# EAGLE design OBD-Schematic (EAGLE 7.4.0)

## Sheet 1 of 4: Power Section
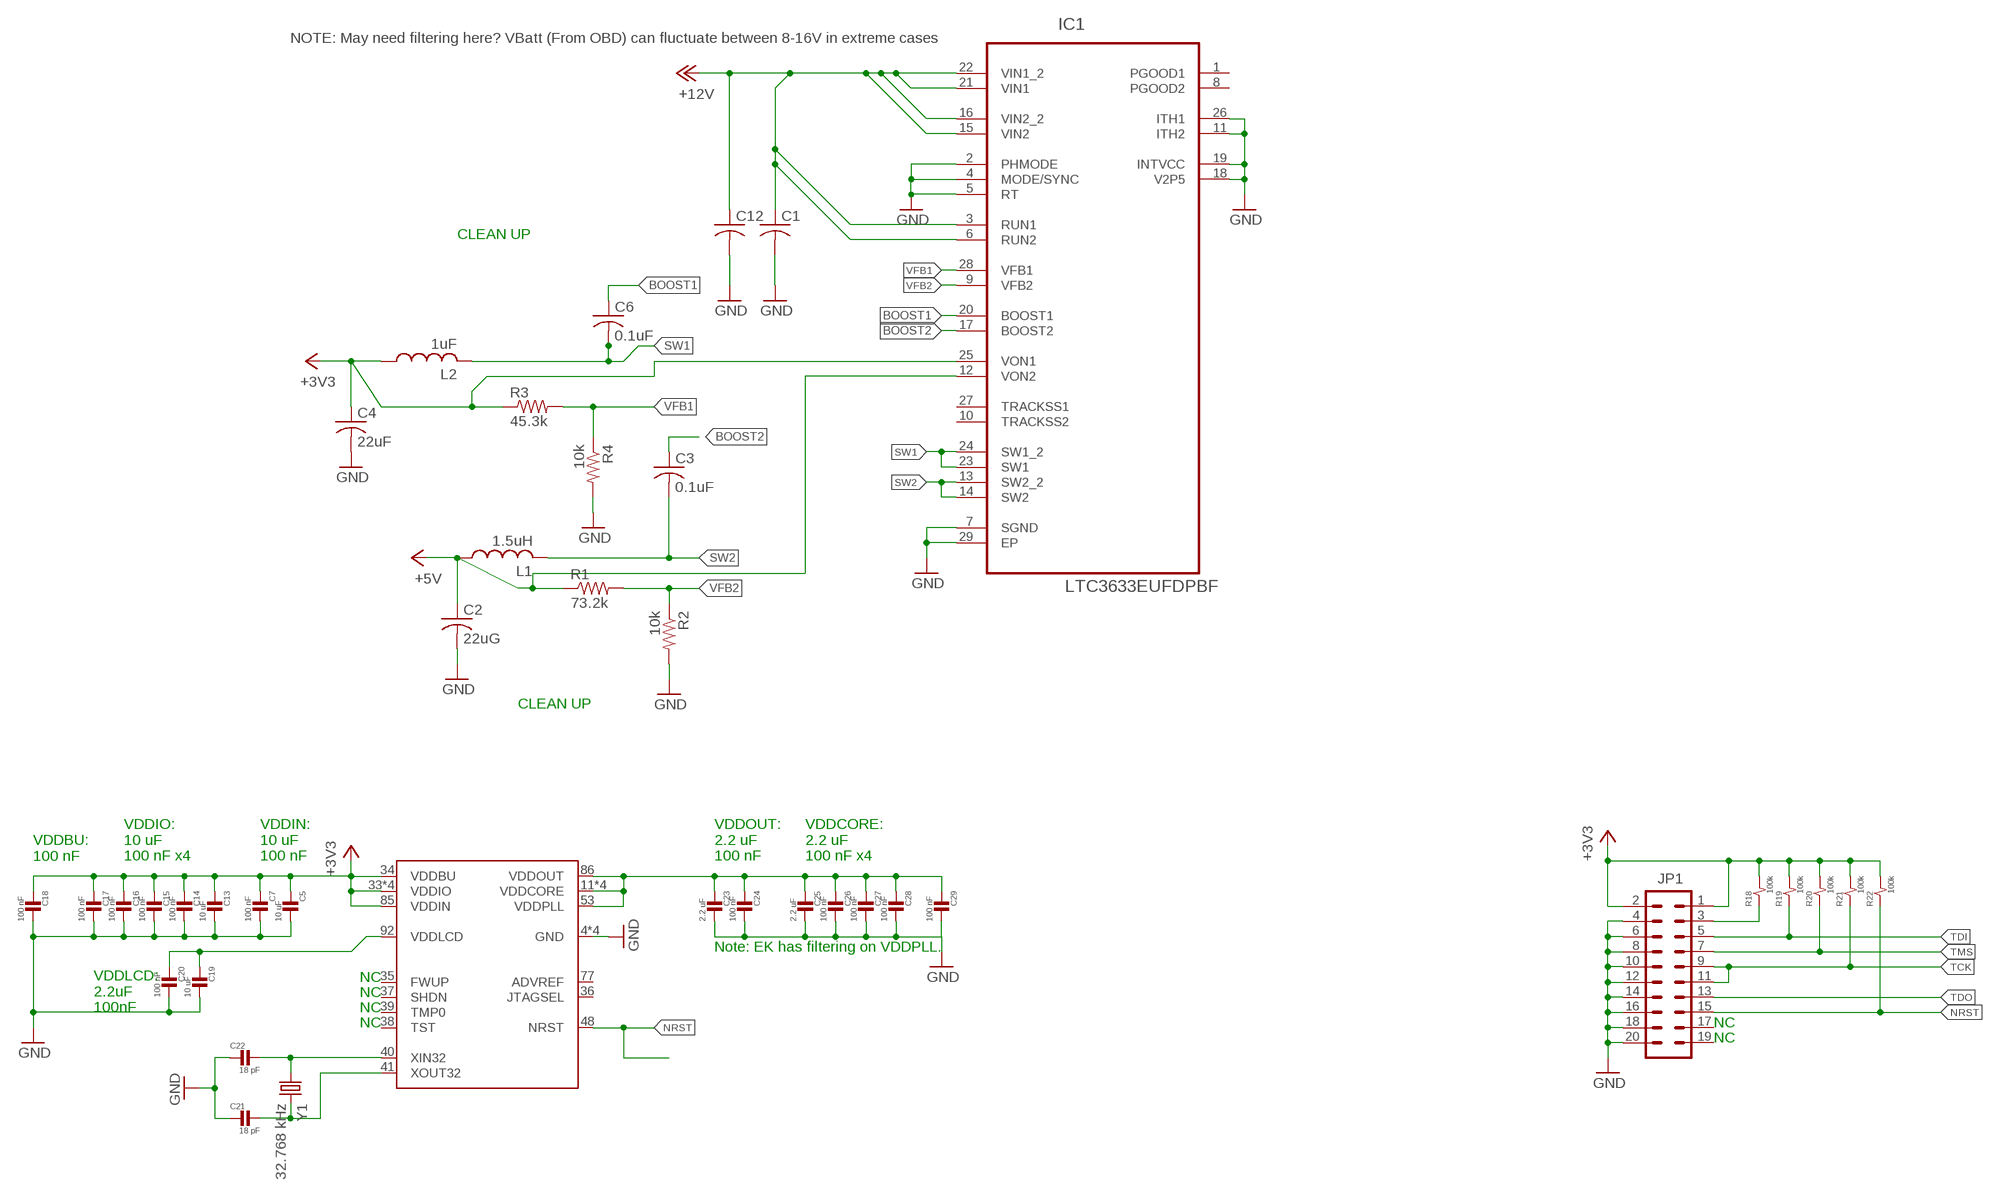
[diagram p0: schematic, sheet 1]

### Parts
C1  C-USC0805  [C0805]
C2  22uG  C-USC0805  [C0805]
C3  0.1uF  C-USC0805  [C0805]
C4  22uF  C-USC0805  [C0805]
C5  10 uF  C0603  [C0603]
C6  0.1uF  C-USC0805  [C0805]
C7  100 nF  C0603  [C0603]
C12  C-USC0805  [C0805]
C13  10 uF  C0603  [C0603]
C14  100 nF  C0603  [C0603]
C15  100 nF  C0603  [C0603]
C16  100 nF  C0603  [C0603]
C17  100 nF  C0603  [C0603]
C18  100 nF  C0603  [C0603]
C19  10 uF  C0603  [C0603]
C20  100 nF  C0603  [C0603]
C21  18 pF  C0603  [C0603]
C22  18 pF  C0603  [C0603]
C23  2.2 uF  C0603  [C0603]
C24  100 nF  C0603  [C0603]
C25  2.2 uF  C0603  [C0603]
C26  100 nF  C0603  [C0603]
C27  100 nF  C0603  [C0603]
C28  100 nF  C0603  [C0603]
C29  100 nF  C0603  [C0603]
IC1  LTC3633EUFDPBF  [QFN50P400X500X80-29N]
JP1  M10X2  [2X10]
L1  1.5uH  L-USL5650M  [L5650M]
L2  1uF  L-USL5650M  [L5650M]
R1  73.2k  R-US_R0805  [R0805]
R2  10k  R-US_R0805  [R0805]
R3  45.3k  R-US_R0805  [R0805]
R4  10k  R-US_R0805  [R0805]
R18  100k  R0603  [R0603]
R19  100k  R0603  [R0603]
R20  100k  R0603  [R0603]
R21  100k  R0603  [R0603]
R22  100k  R0603  [R0603]
U$3  SAM4C32C-100  [LQFP-100]
Y1  32.768 kHz  CRYSTALSM49  [SM49]

### Nets
+3V3: C4.1 C5.1 C7.1 C13.1 C14.1 C15.1 C16.1 C17.1 C18.1 IC1.25(VON1) JP1.1 JP1.2 L2.1 R3.1 R18.2 R19.2 R20.2 R21.2 R22.2 U$3.33(VDDIO) U$3.34(VDDBU) U$3.49(VDDIO) U$3.76(VDDIO) U$3.85(VDDIN) U$3.99(VDDIO) ; also sheet 2,3
+5V: C2.1 IC1.12(VON2) L1.1 R1.1 ; also sheet 3,4
BOOST1: C6.1 IC1.20(BOOST1)
BOOST2: C3.1 IC1.17(BOOST2)
GND: C1.2 C2.2 C4.2 C5.2 C7.2 C12.2 C13.2 C14.2 C15.2 C16.2 C17.2 C18.2 C19.2 C20.2 C21.1 C22.1 C23.2 C24.2 C25.2 C26.2 C27.2 C28.2 C29.2 IC1.2(PHMODE) IC1.4(MODE/SYNC) IC1.5(RT) IC1.7(SGND) IC1.11(ITH2) IC1.18(V2P5) IC1.19(INTVCC) IC1.26(ITH1) IC1.29(EP) JP1.4 JP1.6 JP1.8 JP1.10 JP1.12 JP1.14 JP1.16 JP1.18 JP1.20 R2.2 R4.2 U$3.4(GND) U$3.42(GND) U$3.52(GND) U$3.78(GND) ; also sheet 2,3,4
N$1: JP1.3 R18.1
N$11: C22.2 U$3.40(XIN32) Y1.1
N$12: C21.2 U$3.41(XOUT32) Y1.2
NRST: JP1.15 R22.1 U$3.48(NRST)
SW1: C6.2 IC1.23(SW1) IC1.24(SW1_2) L2.2
SW2: C3.2 IC1.13(SW2_2) IC1.14(SW2) L1.2
TCK: JP1.9 JP1.11 R21.1 ; also sheet 2
TDI: JP1.5 R19.1 ; also sheet 2
TDO: JP1.13 ; also sheet 2
TMS: JP1.7 R20.1 ; also sheet 2
VDDLCD: C19.1 C20.1 U$3.92(VDDLCD)
VDDOUT: C23.1 C24.1 C25.1 C26.1 C27.1 C28.1 C29.1 U$3.11(VDDCORE) U$3.44(VDDCORE) U$3.53(VDDPLL) U$3.63(VDDCORE) U$3.86(VDDOUT) U$3.89(VDDCORE)
VFB1: IC1.28(VFB1) R3.2 R4.1
VFB2: IC1.9(VFB2) R1.2 R2.1
VIN: C1.1 C12.1 IC1.3(RUN1) IC1.6(RUN2) IC1.15(VIN2) IC1.16(VIN2_2) IC1.21(VIN1) IC1.22(VIN1_2) ; supply symbol labelled +12V ; also sheet 2,3
Unconnected: IC1.1(PGOOD1) IC1.8(PGOOD2) IC1.10(TRACKSS2) IC1.27(TRACKSS1) JP1.17 JP1.19 U$3.35(FWUP) U$3.36(JTAGSEL) U$3.37(SHDN) U$3.38(TST) U$3.39(TMP0) U$3.77(ADVREF)

### Notes on the sheet
- NOTE: May need filtering here? VBatt (From OBD) can fluctuate between 8-16V in extreme cases
- CLEAN UP
- CLEAN UP
- VDDBU:
  100 nF
- VDDIO:
  10 uF
  100 nF x4
- VDDIN:
  10 uF
  100 nF
- VDDOUT:
  2.2 uF
  100 nF
- VDDCORE:
  2.2 uF
  100 nF x4
- Note: EK has filtering on VDDPLL.
- NC
- NC
- VDDLCD:
  2.2uF
  100nF
- NC
- NC | NC
- NC

## Sheet 2 of 4
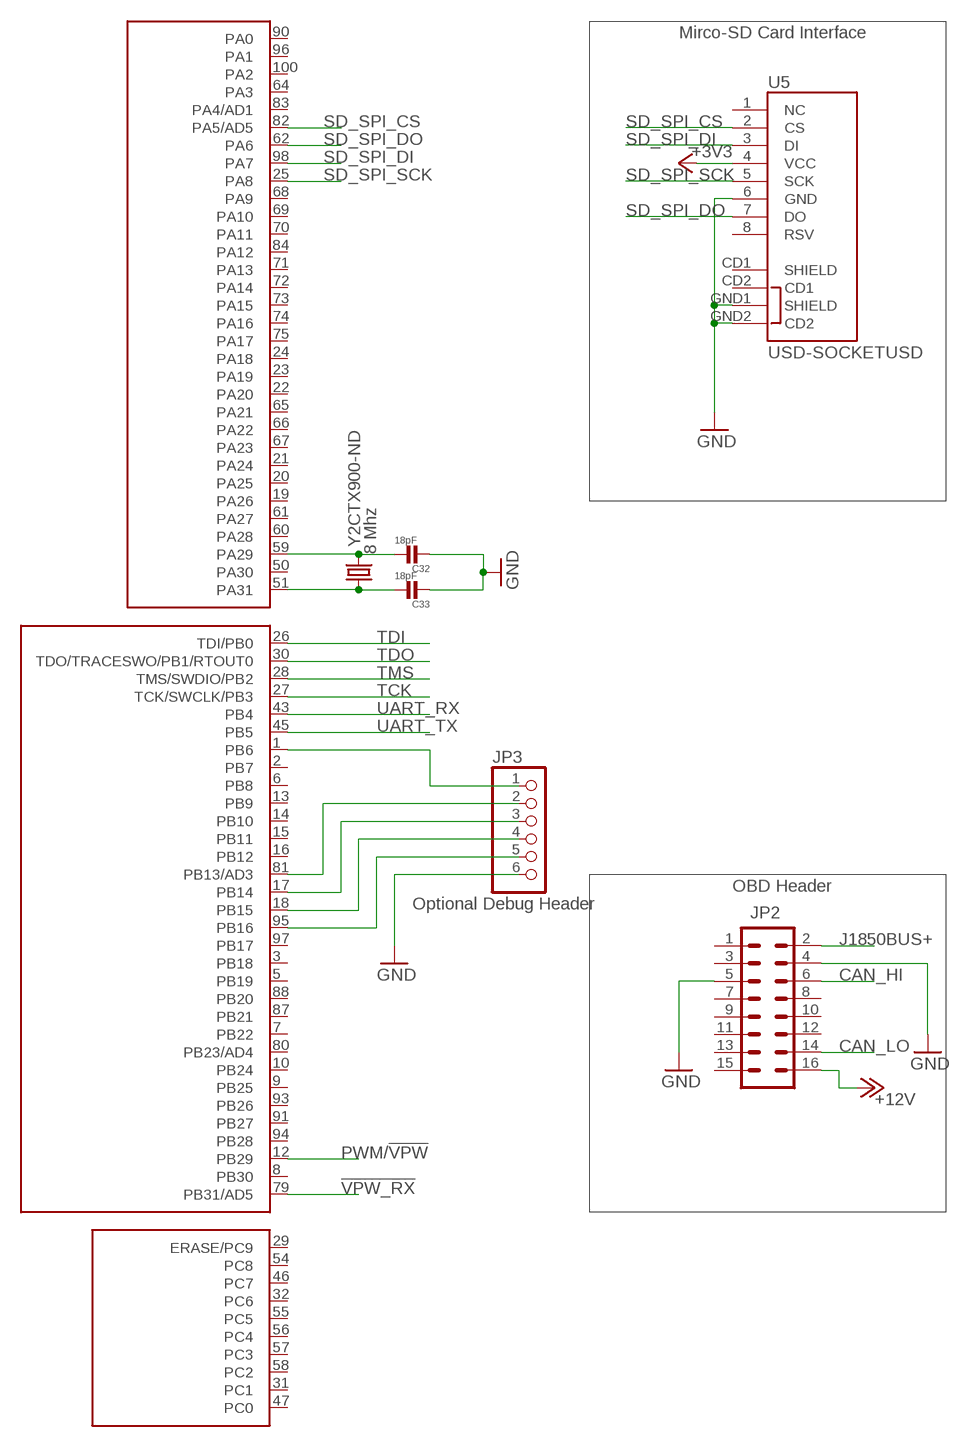
[diagram p1: schematic, sheet 2]

### Parts
C32  18pF  C0603  [C0603]
C33  18pF  C0603  [C0603]
JP2  M08X2  [2X8]
JP3  PINHD-1X6CLEAN  [1X06-CLEAN]
U5  USD-SOCKETUSD  [USD-SOCKET-PP]
Y2CTX900-ND  8 Mhz  CRYSTALHC49US  [HC49US]

### Nets
!VPW_RX: U$3.79(PB31/AD5) ; also sheet 3
+3V3: U5.4(VCC) ; also sheet 1,3
CAN_HI: JP2.6 ; also sheet 3
CAN_LO: JP2.14 ; also sheet 3
GND: C32.1 C33.1 JP2.4 JP2.5 JP3.6 U5.6(GND) U5.GND1(SHIELD) U5.GND2(CD2) ; also sheet 1,3,4
J1850BUS+: JP2.2 ; also sheet 3
N$18: C33.2 U$3.51(PA31) Y2CTX900-ND.1
N$22: C32.2 U$3.59(PA29) Y2CTX900-ND.2
N$31: JP3.1 U$3.1(PB6)
N$32: JP3.2 U$3.81(PB13/AD3)
N$34: JP3.3 U$3.17(PB14)
N$35: JP3.4 U$3.18(PB15)
N$36: JP3.5 U$3.95(PB16)
PWM/!VPW: U$3.12(PB29) ; also sheet 3
SD_SPI_CS: U5.2(CS) U$3.82(PA5/AD5)
SD_SPI_DI: U5.3(DI) U$3.98(PA7)
SD_SPI_DO: U5.7(DO) U$3.62(PA6)
SD_SPI_SCK: U5.5(SCK) U$3.25(PA8)
TCK: U$3.27(TCK/SWCLK/PB3) ; also sheet 1
TDI: U$3.26(TDI/PB0) ; also sheet 1
TDO: U$3.30(TDO/TRACESWO/PB1/RTOUT0) ; also sheet 1
TMS: U$3.28(TMS/SWDIO/PB2) ; also sheet 1
UART_RX: U$3.43(PB4) ; also sheet 4
UART_TX: U$3.45(PB5) ; also sheet 4
VIN: JP2.16 ; supply symbol labelled +12V ; also sheet 1,3
Unconnected: JP2.1 JP2.3 JP2.7 JP2.8 JP2.9 JP2.10 JP2.11 JP2.12 JP2.13 JP2.15 U5.1(NC) U5.8(RSV) U5.CD1(SHIELD) U5.CD2(CD1) U$3.2(PB7) U$3.3(PB18) U$3.5(PB19) U$3.6(PB8) U$3.7(PB22) U$3.8(PB30) U$3.9(PB25) U$3.10(PB24) U$3.13(PB9) U$3.14(PB10) U$3.15(PB11) U$3.16(PB12) U$3.19(PA26) U$3.20(PA25) U$3.21(PA24) U$3.22(PA20) U$3.23(PA19) U$3.24(PA18) U$3.29(ERASE/PC9) U$3.31(PC1) U$3.32(PC6) U$3.46(PC7) U$3.47(PC0) U$3.50(PA30) U$3.54(PC8) U$3.55(PC5) U$3.56(PC4) U$3.57(PC3) U$3.58(PC2) U$3.60(PA28) U$3.61(PA27) U$3.64(PA3) U$3.65(PA21) U$3.66(PA22) U$3.67(PA23) U$3.68(PA9) U$3.69(PA10) U$3.70(PA11) U$3.71(PA13) U$3.72(PA14) U$3.73(PA15) U$3.74(PA16) U$3.75(PA17) U$3.80(PB23/AD4) U$3.83(PA4/AD1) U$3.84(PA12) U$3.87(PB21) U$3.88(PB20) U$3.90(PA0) U$3.91(PB27) U$3.93(PB26) U$3.94(PB28) U$3.96(PA1) U$3.97(PB17) U$3.100(PA2)

### Notes on the sheet
- Mirco-SD Card Interface
- OBD Header
- Optional Debug Header

## Sheet 3 of 4: Interface J1850 VPW and CAN Interface for GM
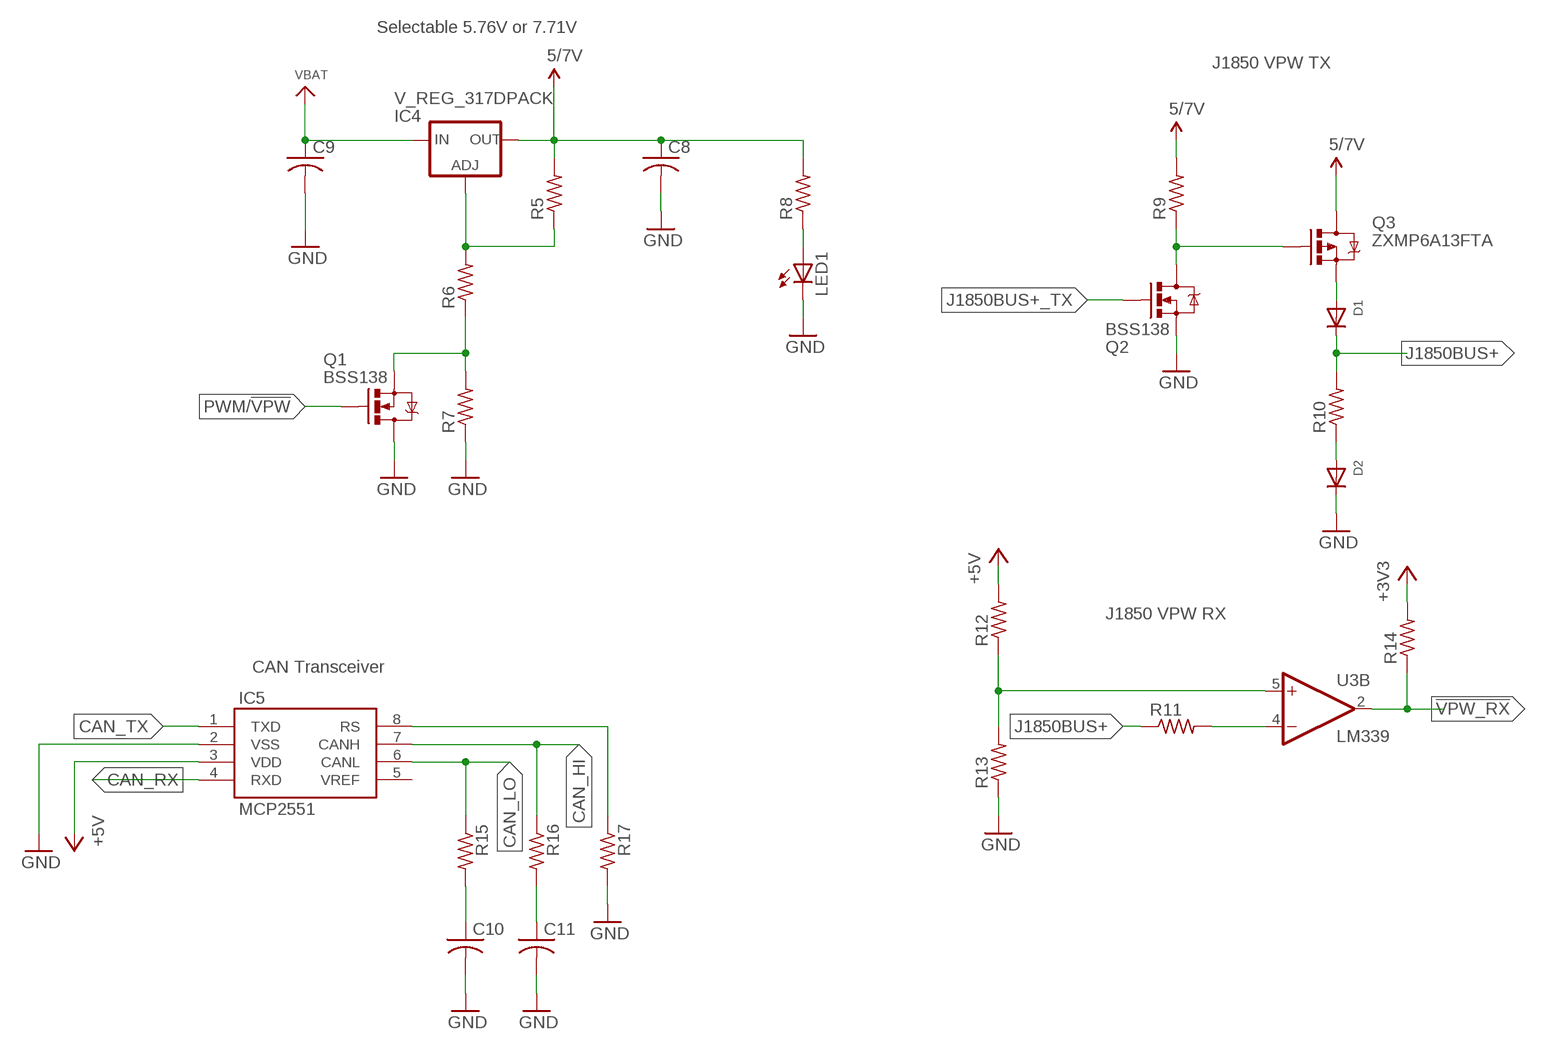
[diagram p2: schematic, sheet 3]

### Parts
C8  C-USC0805  [C0805]
C9  C-USC0805  [C0805]
C10  C-USC0805  [C0805]
C11  C-USC0805  [C0805]
D1  DIODESOT23_REFLOW  [SOT23-R]
D2  DIODESOT23_REFLOW  [SOT23-R]
IC4  V_REG_317DPACK  [V-REG_DPACK]
IC5  MCP2551  [SO08]
LED1  LEDCHIP-LED0805  [CHIP-LED0805]
Q1  BSS138  MOSFET-NCHANNELBSS123LT1G  [SOT23-3]
Q2  BSS138  MOSFET-NCHANNELBSS123LT1G  [SOT23-3]
Q3  ZXMP6A13FTA  MOSFET-PCHANNEL  [SOT23-3]
R5  R-US_R0805  [R0805]
R6  R-US_R0805  [R0805]
R7  R-US_R0805  [R0805]
R8  R-US_R0805  [R0805]
R9  R-US_R0805  [R0805]
R10  R-US_R0805  [R0805]
R11  R-US_R0805  [R0805]
R12  R-US_R0805  [R0805]
R13  R-US_R0805  [R0805]
R14  R-US_R0805  [R0805]
R15  R-US_R0805  [R0805]
R16  R-US_R0805  [R0805]
R17  R-US_R0805  [R0805]
U3  LM339  [TSSOP-14]

### Nets
5/7V: C8.1 IC4.4(OUT) Q3.3(D) R5.2 R8.2 R9.2
!VPW_RX: R14.1 U3.2(B:OUT) ; also sheet 2
+3V3: R14.2 ; also sheet 1,2
+5V: IC5.3(VDD) R12.2 ; also sheet 1,4
CAN_HI: IC5.7(CANH) R16.1 ; also sheet 2
CAN_LO: IC5.6(CANL) R15.1 ; also sheet 2
CAN_RX: IC5.4(RXD)
CAN_TX: IC5.1(TXD)
GND: C8.2 C9.2 C10.2 C11.2 D2.3(C) IC5.2(VSS) LED1.C Q1.3(D) Q2.2(S) R7.1 R13.1 R17.2 ; also sheet 1,2,4
J1850BUS+: D1.3(C) R10.2 R11.1 ; also sheet 2
J1850BUS+_TX: Q2.1(G)
N$3: Q1.2(S) R6.1 R7.2
N$4: IC5.8(RS) R17.1
N$5: R12.1 R13.2 U3.5(B:+IN)
N$6: Q2.3(D) Q3.1(G) R9.1
N$7: IC4.1(ADJ) R5.1 R6.2
N$8: D1.1(A) Q3.2(S)
N$9: R11.2 U3.4(B:-IN)
N$10: D2.1(A) R10.1
N$13: LED1.A R8.1
N$14: C10.1 R15.2
N$15: C11.1 R16.2
PWM/!VPW: Q1.1(G) ; also sheet 2
VIN: C9.1 IC4.3(IN) ; supply symbol labelled VBAT ; also sheet 1,2
Unconnected: IC5.5(VREF) U3.1(A:OUT) U3.6(A:-IN) U3.7(A:+IN) U3.8(C:-IN) U3.9(C:+IN) U3.10(D:-IN) U3.11(D:+IN) U3.13(D:OUT) U3.14(C:OUT)

### Notes on the sheet
- Selectable 5.76V or 7.71V
- J1850 VPW TX
- J1850 VPW RX
- CAN Transceiver

## Sheet 4 of 4: USB
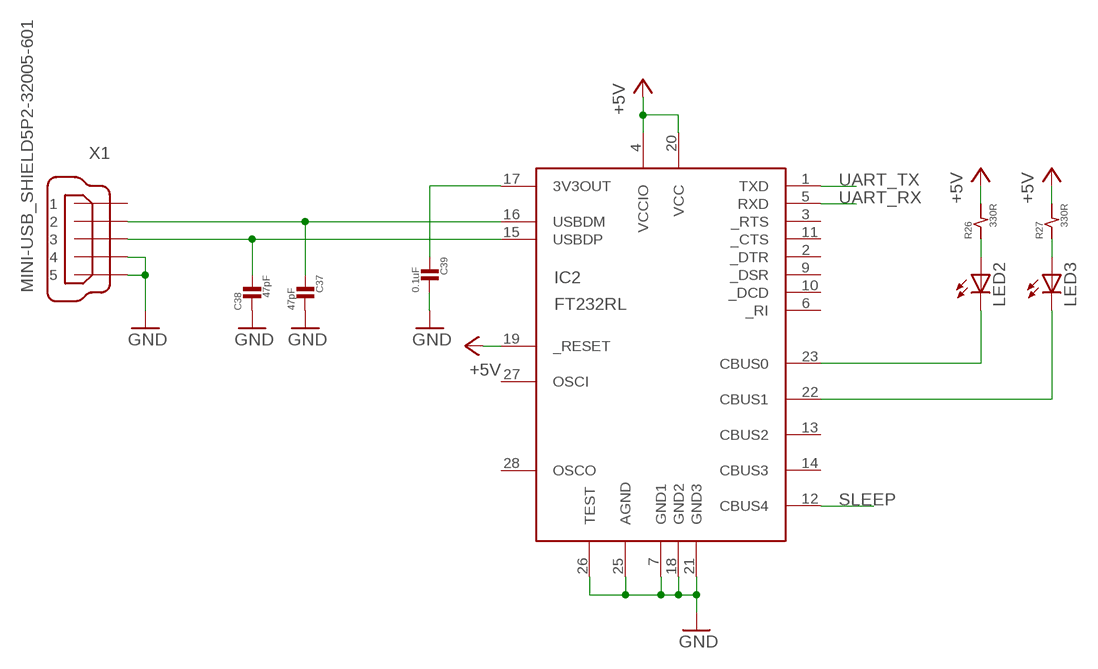
[diagram p3: schematic, sheet 4]

### Parts
C37  47pF  C0603  [C0603]
C38  47pF  C0603  [C0603]
C39  0.1uF  C0603  [C0603]
IC2  FT232RL  [SSOP28DB]
LED2  LEDCHIPLED_0805  [CHIPLED_0805]
LED3  LEDCHIPLED_0805  [CHIPLED_0805]
R26  330R  R0603  [R0603]
R27  330R  R0603  [R0603]
X1  MINI-USB_SHIELD5P2-32005-601  [32005-601]

### Nets
+5V: IC2.4(VCCIO) IC2.19(_RESET) IC2.20(VCC) R26.2 R27.2 ; also sheet 1,3
GND: C37.2 C38.1 C39.2 IC2.7(GND1) IC2.18(GND2) IC2.21(GND3) IC2.25(AGND) IC2.26(TEST) X1.4 X1.5 ; also sheet 1,2,3
N$25: C37.1 IC2.16(USBDM) X1.2
N$26: C38.2 IC2.15(USBDP) X1.3
N$27: LED2.A R26.1
N$28: LED3.A R27.1
N$29: IC2.23(CBUS0) LED2.C
N$30: IC2.22(CBUS1) LED3.C
N$33: C39.1 IC2.17(3V3OUT)
SLEEP: IC2.12(CBUS4)
UART_RX: IC2.5(RXD) ; also sheet 2
UART_TX: IC2.1(TXD) ; also sheet 2
Unconnected: IC2.2(_DTR) IC2.3(_RTS) IC2.6(_RI) IC2.9(_DSR) IC2.10(_DCD) IC2.11(_CTS) IC2.13(CBUS2) IC2.14(CBUS3) IC2.27(OSCI) IC2.28(OSCO) X1.1 X1.M1(S1) X1.M2(S2)

## Power pins joined to a net without a drawn wire
GND: U3.12(P:GND)
VCC: U3.3(P:VCC)

## Library data of the parts
C1-C4 C6 C8-C12 = adafruit:C-US: CAPACITOR, American symbol
C5 C7 C13-C29 C32 C33 C37-C39 = passives:C
D1 D2 = adafruit:DIODE: Diode SMADIODE - SMA Surface Mount Package 20V 1A Schottky Diode Digikey: 641-1014-6-ND DO-1N4148 - Through Hole Small Current Diode SOD-123 20V 1 A (.5mV Vf) Schottky Diode - Digikey: MBRX120TPMSCT-ND SOD-323 10V 570mA (.38mV Vf, 3ns) Schottky Diode - Digikey: ZLLS410CT-ND SOD-523 30V 30mA Schottky Diode (RB751S-40TE61) - Digikey: RB751S-40TE61CT-ND SOT23-R/W - SOT23 Package (R = Solder Paste/Reflow Ovens, W = Hand-Soldering) BAT54Film 40V 300mA - Digikey: 497-7162-1-ND
IC1 = LTC_By_element14_Batch_1:LTC3633EUFDPBF: Dual Channel 3A, 15V Monolithic Synchronous Step-Down Regulator; MANUFACTURER: LTC3633EUFD#PBF; OC_FARNELL: 1839139; OC_NEWARK: 67R4284; PACKAGE: QFN-28; SUPPLIER: Linear technology
IC2 = OBD-Interface:FT232RL: USB UART 4th Generation USB UART (USB <-> Serial) Controller
IC4 = SparkFun-PowerIC:V_REG_317: Voltage Regulator Standard LM317 adjustable voltage regulator. AOI (Adjust Output Input). Google 'LM317 Calculator' for easy to use app to get the two resistor values needed. 240/720 for 5V output. 240/390 for 3.3V output. Spark Fun Electronics SKU : COM-00527; PROD_ID: IC-09888
IC5 = SparkFun-DigitalIC:MCP2551: CAN transceiver; PROD_ID: IC-09907
JP1 = SparkFun-Connectors:M10X2: This was SPECIALLY designed to be used with our Graphic LCD Backpack. Be sure you want to use this! It is not only staggered on each line of header holes, but IT IS ALSO offset of the center point of the top and bottom lines by 5 mil. This causes the headers to lock into place on the "standard" footprint on the LCD screen. The extra squares on the tdocu layer are there simply to reference other pins (if you were to actually populate a longer header than ten long - this is what we do with the backpacks).
JP2 = SparkFun-Connectors:M08X2: .1" headers, two rows of 8 each
JP3 = adafruit:PINHD-1X6: PIN HEADER
L1 L2 = rcl:L-US: INDUCTOR, American symbol
LED1-LED3 = adafruit:LED: LED OSRAM: - CHIPLED LG R971, LG N971, LY N971, LG Q971, LY Q971, LO R971, LY R971 LH N974, LH R974 LS Q976, LO Q976, LY Q976 LO Q996 - Hyper CHIPLED LW Q18S LB Q993, LB Q99A, LB R99A - SideLED LS A670, LO A670, LY A670, LG A670, LP A670 LB A673, LV A673, LT A673, LW A673 LH A674 LY A675 LS A676, LA A676, LO A676, LY A676, LW A676 LS A679, LY A679, LG A679 - Hyper Micro SIDELED® LS Y876, LA Y876, LO Y876, LY Y876 LT Y87S - SmartLED LW L88C, LW L88S LB L89C, LB L89S, LG L890 LS L89K, LO L89K, LY L89K LS L896, LA L896, LO L896, LY L896 - TOPLED LS T670, LO T670, LY T670, LG T670, LP T670 LSG T670, LSP T670, LSY T670, LOP T670, LYG T670 LG T671, LOG T671, LSG T671 LB T673, LV T673, LT T673, LW T673 LH T674 LS T676, LA T676, LO T676, LY T676, LB T676, LH T676, LSB T676, LW T676 LB T67C, LV T67C, LT T67C, LS T67K, LO T67K, LY T67K, LW E67C LS E67B, LA E67B, LO E67B, LY E67B, LB E67C, LV E67C, LT E67C LW T67C LS T679, LY T679, LG T679 LS T770, LO T770, LY T770, LG T770, LP T770 LB T773, LV T773, LT T773, LW T773 LH T774 LS E675, LA E675, LY E675, LS T675 LS T776, LA T776, LO T776, LY T776, LB T776 LHGB T686 LT T68C, LB T68C - Hyper Mini TOPLED® LB M676 - Mini TOPLED Santana® LG M470 LS M47K, LO M47K, LY M47K Source: http://www.osram.convergy.de/
Q1 Q2 = SparkFun-DiscreteSemi:MOSFET-NCHANNEL: Common NMOSFET Parts MFG P/N Store ID Prod ID FDD8780 TRANS-09984 SI7820DN TRANS-11055 FDS6630A IC-08089 2N7002PW TRANS-11151 FQP30N06L COM-10213 TRANS-10060 BSS123LT1G TRANS-08345 BSS138 TRANS-00830 BS170 2N7000; PROD_ID: TRANS-08345
Q3 = SparkFun-DiscreteSemi:MOSFET-PCHANNEL: Generic PMOSFET IRLML2244 - TRANS-11153 (SOT-23 -20V -4.3A) (1.Gate 2.Source 3.Drain) FQP27P06 - COM-10349 <http://www.sparkfun.com/products/10349> (TO-220 -60V -27A) (1.Gate 2.Source 3.Drain); PROD_ID: TRANS-08285
R1-R17 = adafruit:R-US_: RESISTOR, American symbol
R18-R22 R26 R27 = passives:R
U3 = SparkFun-AnalogIC:LM339: Based on information from the SLCS006N datasheet from TI (www.ti.com). Change Log Date Author Change July 16, 2008 nick@scantool.net Device created.; DESC: IC, Quad Comparator; MANUF: Texas Instruments; PARTNUM: LM339PWR; SUPPLIER: Digikey:296-6607-1-ND; VALSTAT: PARTNUM
U5 = SparkFun-Connectors:USD-SOCKET: microSD Socket Push-push type uSD socket. Schematic element and footprint production proven. Spark Fun Electronics SKU : PRT-00127. tDoc lines correctly indicate media card edge positions when inserting (unlocked, locked, depressed). NOTE: CD1 and CD2 are connected internally
U$3 = OBD-Interface:SAM4C32C-100
X1 = con-cypressindustries:MINI-USB_SHIELD5P2-: MINI USB-B R/A DIP 5pol. Source: www.cypressindustries.com; OC_FARNELL: unknown; OC_NEWARK: unknown
Y1 = adafruit:CRYSTAL: CRYSTAL; OC_FARNELL: unknown; OC_NEWARK: unknown
Y2CTX900-ND = SparkFun-FreqCtrl:CRYSTAL: Various standard crystals. Proven footprints.

## Board
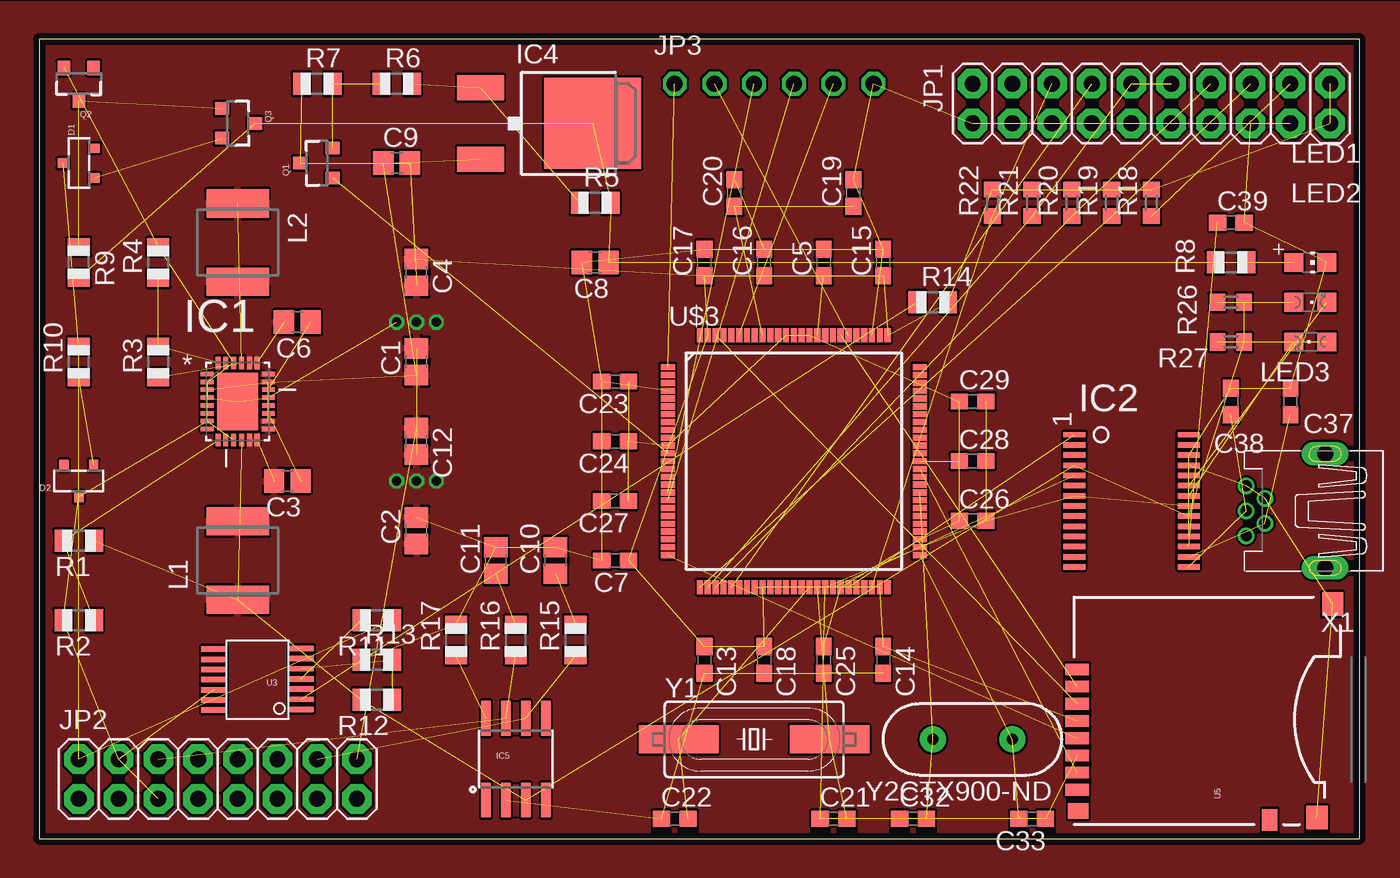
[diagram p4: board, top side]

Size 84.44 x 51.1 mm. Coordinates in mm from the lower left corner, seen from the top.
Outline: 0,0 84.44,0 84.44,51.1 0,51.1 0,0
Copper layers (1*2)+(15*16): Top 0.0356mm / dielectric 1.5011mm / Route2 0.0356mm / dielectric 0.1499mm / Route15 0.0356mm / dielectric 0.2007mm / Bottom 0.0356mm
Design rules "LaenPCBOrder *": minimum track width 6mil, minimum drill 13mil, track to track 6mil, track to pad 6mil, pad to pad 6mil, via to via 6mil, smd to smd 6mil, copper to edge 15mil, drill to drill 6mil, minimum pad ring 7mil, minimum via ring 7mil, stop-mask expansion 3mil, vias tented up to drill 0mil, thermal gap 10mil

### Footprints (pad centres in the part's own frame; a part is rotated, then mirrored left to right if it is on the bottom)
C0805 = smd 1.3 x 1.5: 1 -0.85,0; 2 0.85,0
C0603 = smd 1.1 x 1: 1 -0.85,0; 2 0.85,0
SOT23-R = smd 0.6 x 0.7: 1 -0.95,-1; 2 0.95,-1; 3 0,1
QFN50P400X500X80-29N = smd 0.813 x 0.305: 1 -1.956,1.753; 2 -1.956,1.245; 3 -1.956,0.762; 4 -1.956,0.254; 5 -1.956,-0.254; 6 -1.956,-0.762; 7 -1.956,-1.245; 8 -1.956,-1.753; 15 1.956,-1.753; 16 1.956,-1.245; 17 1.956,-0.762; 18 1.956,-0.254; 19 1.956,0.254; 20 1.956,0.762; 21 1.956,1.245; 22 1.956,1.753 | smd 0.305 x 0.813: 9 -1.245,-2.464; 10 -0.762,-2.464; 11 -0.254,-2.464; 12 0.254,-2.464; 13 0.762,-2.464; 14 1.245,-2.464; 23 1.245,2.464; 24 0.762,2.464; 25 0.254,2.464; 26 -0.254,2.464; 27 -0.762,2.464; 28 -1.245,2.464 | smd 2.642 x 3.658: 29 0,0
SSOP28DB = smd 0.348 x 1.397: 1 -4.225,-3.656; 2 -3.575,-3.656; 3 -2.925,-3.656; 4 -2.275,-3.656; 5 -1.625,-3.656; 6 -0.975,-3.656; 7 -0.325,-3.656; 8 0.325,-3.656; 9 0.975,-3.656; 10 1.625,-3.656; 11 2.275,-3.656; 12 2.925,-3.656; 13 3.575,-3.656; 14 4.225,-3.656; 15 4.225,3.656; 16 3.575,3.656; 17 2.925,3.656; 18 2.275,3.656; 19 1.625,3.656; 20 0.975,3.656; 21 0.325,3.656; 22 -0.325,3.656; 23 -0.975,3.656; 24 -1.625,3.656; 25 -2.275,3.656; 26 -2.925,3.656; 27 -3.575,3.656; 28 -4.225,3.656
V-REG_DPACK = smd 1.6 x 3: 1 -2.28,-4.8; 3 2.28,-4.8 | smd 5.8 x 6.2: 4 0,2.38
SO08 = smd 0.61 x 2.21: 1 -1.905,-2.616; 2 -0.635,-2.616; 3 0.635,-2.616; 4 1.905,-2.616; 5 1.905,2.616; 6 0.635,2.616; 7 -0.635,2.616; 8 -1.905,2.616
2X10 = drill 1.016 pad 1.88 octagon: 1 -11.43,-1.27; 2 -11.43,1.27; 3 -8.89,-1.27; 4 -8.89,1.27; 5 -6.35,-1.27; 6 -6.35,1.27; 7 -3.81,-1.27; 8 -3.81,1.27; 9 -1.27,-1.27; 10 -1.27,1.27; 11 1.27,-1.27; 12 1.27,1.27; 13 3.81,-1.27; 14 3.81,1.27; 15 6.35,-1.27; 16 6.35,1.27; 17 8.89,-1.27; 18 8.89,1.27; 19 11.43,-1.27; 20 11.43,1.27
2X8 = drill 1.016 pad 1.88 octagon: 1 0,0; 2 0,2.54; 3 2.54,0; 4 2.54,2.54; 5 5.08,0; 6 5.08,2.54; 7 7.62,0; 8 7.62,2.54; 9 10.16,0; 10 10.16,2.54; 11 12.7,0; 12 12.7,2.54; 13 15.24,0; 14 15.24,2.54; 15 17.78,0; 16 17.78,2.54
1X06-CLEAN = drill 1.016 octagon: 1 -6.35,0; 2 -3.81,0; 3 -1.27,0; 4 1.27,0; 5 3.81,0; 6 6.35,0
L5650M = smd 1.8 x 4: 1 -2.5,0; 2 2.5,0
CHIP-LED0805 = smd 1.2 x 1.2: A 0,-1.05; C 0,1.05
CHIPLED_0805 = smd 1.2 x 1.2: A 0,-1.05; C 0,1.05
SOT23-3 = smd 0.8 x 0.9: 1 -0.95,-1; 2 0.95,-1; 3 0,1.1
R0805 = smd 1.1 x 1.4: 1 -1,0; 2 1,0
R0603 = smd 1 x 1.1: 1 -0.85,0; 2 0.85,0
TSSOP-14 = smd 1.6 x 0.35: 1 -2.8,1.9; 2 -2.8,1.25; 3 -2.8,0.6; 4 -2.8,-0.05; 5 -2.8,-0.7; 6 -2.8,-1.35; 7 -2.8,-2; 8 2.8,-1.95; 9 2.8,-1.3; 10 2.8,-0.65; 11 2.8,0; 12 2.8,0.65; 13 2.8,1.3; 14 2.8,1.95
USD-SOCKET-PP = smd 0.75 x 1.5: 1 3.2,16.8; 2 2.1,16.8; 3 1,16.8; 4 -0.1,16.8; 5 -1.2,16.8; 6 -2.3,16.8; 7 -3.4,16.8; 8 -4.5,16.8 | smd 1 x 1.3: CD1 -5.85,16.75 | smd 1.4 x 1: CD2 -6.425,4.5 | smd 1.5 x 1.35: GND1 -6.275,1.475; GND2 7.375,0.475
LQFP-100 = smd 0.9 x 0.4: 1 -8.05,6; 2 -8.05,5.5; 3 -8.05,5; 4 -8.05,4.5; 5 -8.05,4; 6 -8.05,3.5; 7 -8.05,3; 8 -8.05,2.5; 9 -8.05,2; 10 -8.05,1.5; 11 -8.05,1; 12 -8.05,0.5; 13 -8.05,0; 14 -8.05,-0.5; 15 -8.05,-1; 16 -8.05,-1.5; 17 -8.05,-2; 18 -8.05,-2.5; 19 -8.05,-3; 20 -8.05,-3.5; 21 -8.05,-4; 22 -8.05,-4.5; 23 -8.05,-5; 24 -8.05,-5.5; 25 -8.05,-6; 51 8.05,-6; 52 8.05,-5.5; 53 8.05,-5; 54 8.05,-4.5; 55 8.05,-4; 56 8.05,-3.5; 57 8.05,-3; 58 8.05,-2.5; 59 8.05,-2; 60 8.05,-1.5; 61 8.05,-1; 62 8.05,-0.5; 63 8.05,0; 64 8.05,0.5; 65 8.05,1; 66 8.05,1.5; 67 8.05,2; 68 8.05,2.5; 69 8.05,3; 70 8.05,3.5; 71 8.05,4; 72 8.05,4.5; 73 8.05,5; 74 8.05,5.5; 75 8.05,6 | smd 0.4 x 0.9: 26 -6,-8.05; 27 -5.5,-8.05; 28 -5,-8.05; 29 -4.5,-8.05; 30 -4,-8.05; 31 -3.5,-8.05; 32 -3,-8.05; 33 -2.5,-8.05; 34 -2,-8.05; 35 -1.5,-8.05; 36 -1,-8.05; 37 -0.5,-8.05; 38 0,-8.05; 39 0.5,-8.05; 40 1,-8.05; 41 1.5,-8.05; 42 2,-8.05; 43 2.5,-8.05; 44 3,-8.05; 45 3.5,-8.05; 46 4,-8.05; 47 4.5,-8.05; 48 5,-8.05; 49 5.5,-8.05; 50 6,-8.05; 76 6,8.05; 77 5.5,8.05; 78 5,8.05; 79 4.5,8.05; 80 4,8.05; 81 3.5,8.05; 82 3,8.05; 83 2.5,8.05; 84 2,8.05; 85 1.5,8.05; 86 1,8.05; 87 0.5,8.05; 88 0,8.05; 89 -0.5,8.05; 90 -1,8.05; 91 -1.5,8.05; 92 -2,8.05; 93 -2.5,8.05; 94 -3,8.05; 95 -3.5,8.05; 96 -4,8.05; 97 -4.5,8.05; 98 -5,8.05; 99 -5.5,8.05; 100 -6,8.05
32005-601 = drill 0.7 pad 1.016: 1 2.825,1.6; 2 1.625,0.8; 3 2.825,0; 4 1.625,-0.8; 5 2.825,-1.6 | drill 1 pad 1.422 long: M1 -2.225,3.65; M2 -2.225,-3.65
SM49 = smd 5.08 x 1.778: 1 -4.826,0; 2 4.826,0
HC49US = drill 0.7 pad 1.651: 1 -2.54,0; 2 2.54,0

### Placement (x,y rotation side)
C1  24.13,30.48 90 top
C2  24.13,19.68 90 top
C3  15.88,22.86 180 top
C4  24.13,36.2 270 top
C5  50.16,36.83 90 top
C6  16.51,33.02 180 top
C7  36.83,17.78 180 top
C8  35.56,36.83 180 top
C9  22.86,43.18 0 top
C10  33.02,17.78 90 top
C11  29.21,17.78 90 top
C12  24.13,25.4 270 top
C13  42.55,11.43 270 top
C14  53.98,11.43 270 top
C15  53.98,36.83 90 top
C16  46.36,36.83 90 top
C17  42.55,36.83 90 top
C18  46.36,11.43 270 top
C19  52.07,41.27 90 top
C20  44.45,41.27 90 top
C21  50.8,1.27 0 top
C22  40.64,1.27 0 top
C23  36.83,29.21 180 top
C24  36.83,25.4 180 top
C25  50.16,11.43 270 top
C26  59.69,20.32 0 top
C27  36.83,21.59 180 top
C28  59.69,24.13 0 top
C29  59.69,27.94 0 top
C32  55.88,1.27 0 top
C33  63.5,1.27 180 top
C37  80.01,27.94 90 top
C38  76.2,27.94 270 top
C39  76.2,39.37 0 top
D1  2.54,43.18 90 top
D2  2.54,22.86 180 top
IC1  12.7,27.94 0 top
IC2  69.85,21.59 270 top
IC4  33.02,45.72 270 top
IC5  30.48,5.08 0 top
JP1  71.12,46.99 180 top
JP2  2.54,2.54 0 top
JP3  46.99,48.26 0 top
L1  12.7,17.78 90 top
L2  12.7,38.1 270 top
LED1  81.28,36.83 270 top
LED2  81.28,34.29 270 top
LED3  81.28,31.75 90 top
Q1  17.78,43.18 90 top
Q2  2.54,48.26 180 top
Q3  12.7,45.72 270 top
R1  2.54,19.05 180 top
R2  2.54,13.97 180 top
R3  7.62,30.48 90 top
R4  7.62,36.83 90 top
R5  35.56,40.64 0 top
R6  22.86,48.26 0 top
R7  17.78,48.26 0 top
R8  76.2,36.83 0 top
R9  2.54,36.83 270 top
R10  2.54,30.48 90 top
R11  21.59,13.97 180 top
R12  21.59,8.89 180 top
R13  21.59,11.43 0 top
R14  57.15,34.29 0 top
R15  34.29,12.7 90 top
R16  30.48,12.7 90 top
R17  26.67,12.7 90 top
R18  71.12,40.64 90 top
R19  68.58,40.64 90 top
R20  66.04,40.64 90 top
R21  63.5,40.64 90 top
R22  60.96,40.64 90 top
R26  76.2,34.29 0 top
R27  76.2,31.75 0 top
U3  13.97,10.16 180 top
U5  83.19,7.62 90 top
U$3  48.26,24.13 0 top
X1  80.01,20.95 180 top
Y1  45.72,6.35 0 top
Y2CTX900-ND  59.69,6.35 180 top

### Tracks (layer width: path | path; a pad name or v marks a point on that pad's centre or on a via)
5/7V  (5 unrouted)
!VPW_RX  (2 unrouted)
+3V3  (25 unrouted)
  pour Top: 10.16,41.91 16.51,41.91 16.51,40.64 26.67,40.64 26.67,36.83 16.51,36.83 16.51,38.1 10.16,38.1
+5V  (9 unrouted)
  pour Top: 8.89,13.97 17.78,13.97 17.78,15.24 25.4,15.24 25.4,16.51 25.4,19.05 16.51,19.05 16.51,17.78 8.89,17.78
BOOST1  (1 unrouted)
BOOST2  (1 unrouted)
CAN_HI  (2 unrouted)
CAN_LO  (2 unrouted)
GND  (via drill 0.6 layers 1-2)  (75 unrouted)
  other vias: 22.86,33.02 24.13,33.02 25.4,33.02 22.86,22.86 24.13,22.86 25.4,22.86
  pour Top: 19.05,24.77 26.67,24.77 26.67,20.32 19.05,20.32
  pour Top: 19.05,35.56 26.67,35.56 26.67,31.11 19.05,31.11
J1850BUS+  (3 unrouted)
N$1  (1 unrouted)
N$2
  pour Top: 0,53.34 87.63,53.34 87.63,-3.81 -2.54,-3.81 -2.54,53.34
N$3  (2 unrouted)
N$4  (1 unrouted)
N$5  (2 unrouted)
N$6  (2 unrouted)
N$7  (2 unrouted)
N$8  (1 unrouted)
N$9  (1 unrouted)
N$10  (1 unrouted)
N$11  (2 unrouted)
N$12  (2 unrouted)
N$13  (1 unrouted)
N$14  (1 unrouted)
N$15  (1 unrouted)
N$18  (2 unrouted)
N$22  (2 unrouted)
N$25  (2 unrouted)
N$26  (2 unrouted)
N$27  (1 unrouted)
N$28  (1 unrouted)
N$29  (1 unrouted)
N$30  (1 unrouted)
N$31  (1 unrouted)
N$32  (1 unrouted)
N$33  (1 unrouted)
N$34  (1 unrouted)
N$35  (1 unrouted)
N$36  (1 unrouted)
NRST  (2 unrouted)
PWM/!VPW  (1 unrouted)
SD_SPI_CS  (1 unrouted)
SD_SPI_DI  (1 unrouted)
SD_SPI_DO  (1 unrouted)
SD_SPI_SCK  (1 unrouted)
SW1  (1 unrouted)
  pour Top: 13.34,29.84 13.97,29.84 13.97,31.75 15.24,31.75 15.24,37.47 10.16,37.47 10.16,31.75 13.34,31.75
SW2  (1 unrouted)
  pour Top: 13.34,26.04 13.97,26.04 13.97,24.13 15.24,24.13 15.24,18.41 10.16,18.41 10.16,22.86 13.34,22.86
TCK  (3 unrouted)
TDI  (2 unrouted)
TDO  (1 unrouted)
TMS  (2 unrouted)
UART_RX  (1 unrouted)
UART_TX  (1 unrouted)
VDDLCD  (2 unrouted)
VDDOUT  (12 unrouted)
VFB1  (2 unrouted)
VFB2  (2 unrouted)
VIN  (7 unrouted)
  pour Top: 13.97,29.84 26.67,29.84 26.67,26.04 13.97,26.04 13.97,26.67 20.32,26.67 20.32,29.21 13.97,29.21